# EAGLE design carte_ultrason (EAGLE 6.1)
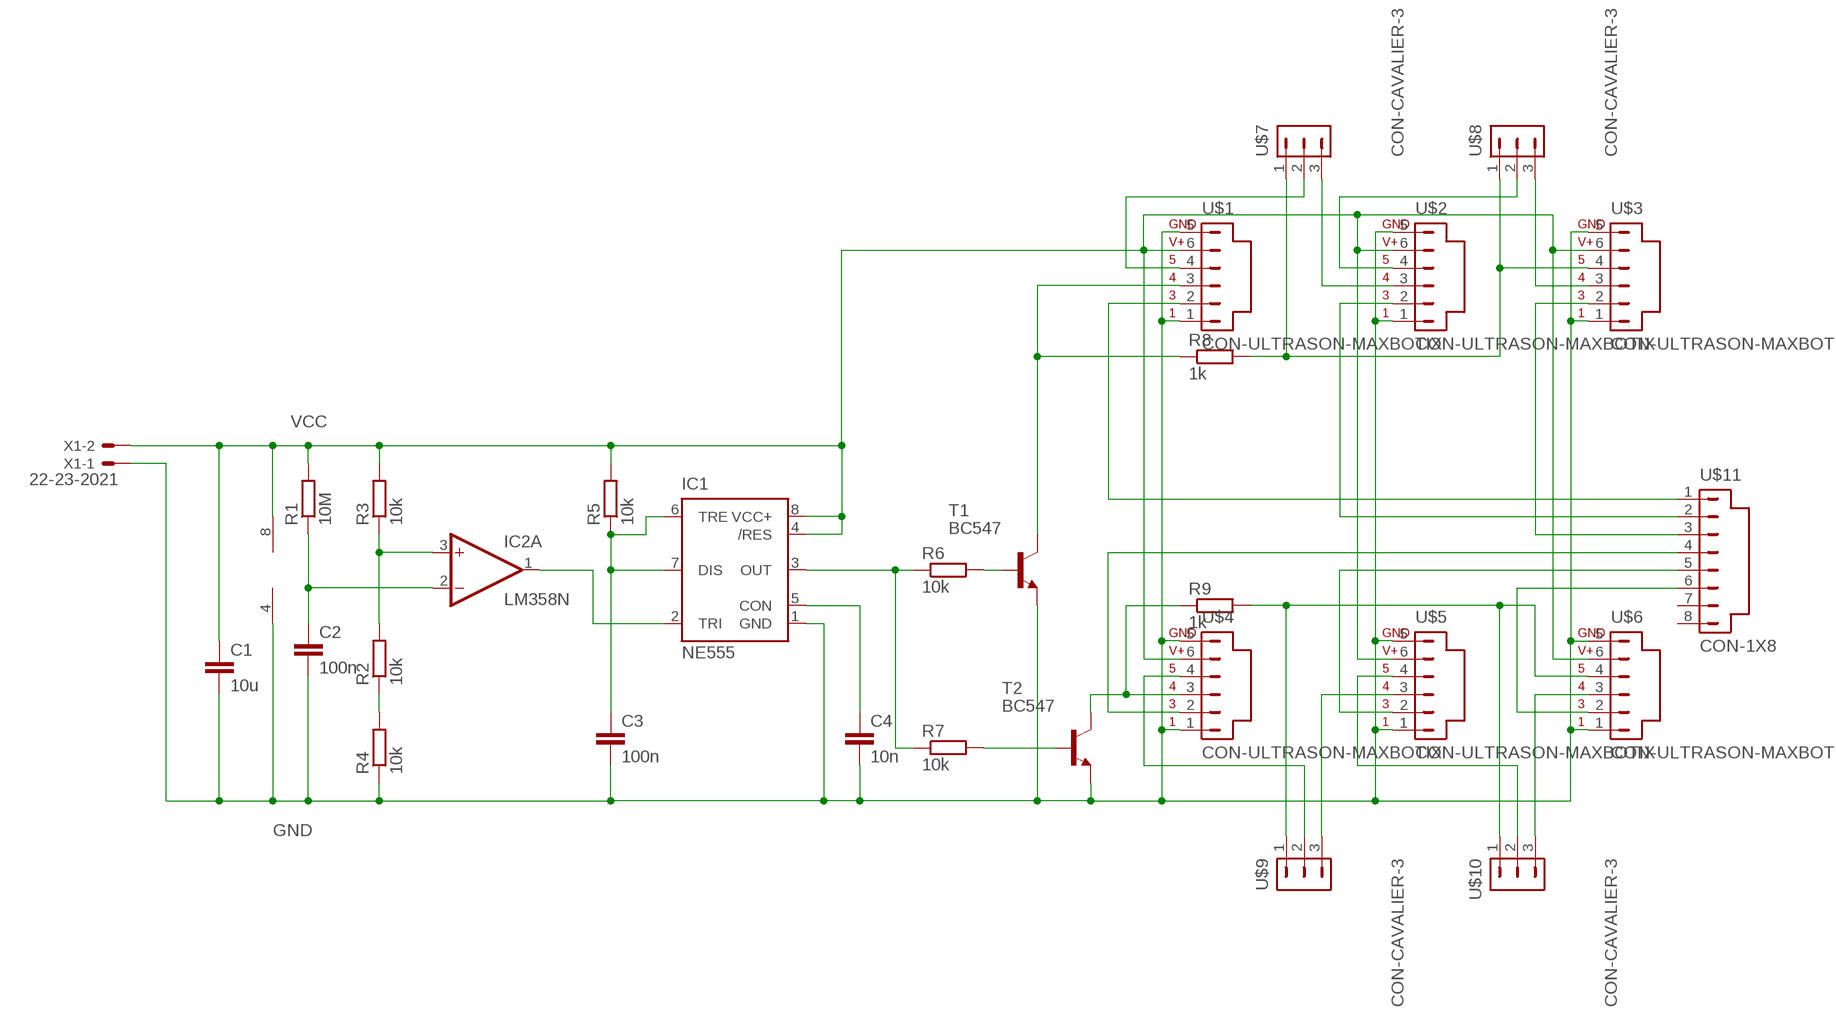
[diagram p0: schematic, sheet 1]

## Parts
C1  10u  C-EUC1206K  [C1206K]
C2  100n  C-EUC0805K  [C0805K]
C3  100n  C-EUC0805K  [C0805K]
C4  10n  C-EUC0805K  [C0805K]
IC1  NE555  [DIL-08]
IC2  LM358N  [DIL08]
R1  10M  R-EU_R0805W  [R0805W]
R2  10k  R-EU_R0805W  [R0805W]
R3  10k  R-EU_0207/10  [0207/10]
R4  10k  R-EU_R0805W  [R0805W]
R5  10k  R-EU_R0805W  [R0805W]
R6  10k  R-EU_0207/10  [0207/10]
R7  10k  R-EU_0207/10  [0207/10]
R8  1k  R-EU_0207/10  [0207/10]
R9  1k  R-EU_R0805W  [R0805W]
T1  BC547  [TO92]
T2  BC547  [TO92]
U$1  CON-ULTRASON-MAXBOTIX  [CON-1X6]
U$2  CON-ULTRASON-MAXBOTIX  [CON-1X6]
U$3  CON-ULTRASON-MAXBOTIX  [CON-1X6]
U$4  CON-ULTRASON-MAXBOTIX  [CON-1X6]
U$5  CON-ULTRASON-MAXBOTIX  [CON-1X6]
U$6  CON-ULTRASON-MAXBOTIX  [CON-1X6]
U$7  CON-CAVALIER-3  [CON-CAVALIER-3]
U$8  CON-CAVALIER-3  [CON-CAVALIER-3]
U$9  CON-CAVALIER-3  [CON-CAVALIER-3]
U$10  CON-CAVALIER-3  [CON-CAVALIER-3]
U$11  CON-1X8  [CON-1X8]
X1  22-23-2021  [22-23-2021]

## Nets
GND: C1.2 C2.2 C3.2 C4.2 IC1.1(GND) IC2.4(P:V-) R4.1 T1.1(E) T2.1(E) U$1.1 U$1.5(GND) U$2.1 U$2.5(GND) U$3.1 U$3.5(GND) U$4.1 U$4.5(GND) U$5.1 U$5.5(GND) U$6.1 U$6.5(GND) X1.1
N$1: IC1.2(TRI) IC2.1(A:OUT)
N$2: C3.1 IC1.6(TRE) IC1.7(DIS) R5.1
N$3: C2.1 IC2.2(A:-IN) R1.1
N$4: R2.1 R4.2
N$5: IC2.3(A:+IN) R2.2 R3.1
N$7: C4.1 IC1.5(CON)
N$8: IC1.3(OUT) R6.1 R7.1
N$9: R6.2 T1.2(B)
N$10: R7.2 T2.2(B)
N$11: U$1.4 U$7.2
N$12: R9.1 T2.3(C) U$4.3
N$13: U$6.2 U$11.6
N$14: U$2.3 U$7.3
N$15: U$2.4 U$8.2
N$16: U$3.3 U$8.3
N$17: U$4.4 U$9.2
N$18: R9.2 U$6.4 U$9.1 U$10.1
N$19: U$5.3 U$9.3
N$20: U$5.4 U$10.2
N$21: U$6.3 U$10.3
N$22: U$5.2 U$11.5
N$23: R8.2 U$3.4 U$7.1 U$8.1
N$24: U$4.2 U$11.4
N$25: U$1.2 U$11.1
N$26: U$3.2 U$11.3
N$27: U$2.2 U$11.2
N$28: R8.1 T1.3(C) U$1.3
VCC: C1.1 IC1.4(/RES) IC1.8(VCC+) IC2.8(P:V+) R1.2 R3.2 R5.2 U$1.6(V+) U$2.6(V+) U$3.6(V+) U$4.6(V+) U$5.6(V+) U$6.6(V+) X1.2
Unconnected: IC2.5(B:+IN) IC2.6(B:-IN) IC2.7(B:OUT) U$11.7 U$11.8

## Library data of the parts
C1-C4 = rcl:C-EU: CAPACITOR, European symbol
IC1 = st-microelectronics:NE555: General purpose bipolar Timer; MF: Arrow Electronics; MPN: NE555N; OC_FARNELL: 1467742; OC_NEWARK: 89K1486
IC2 = linear:LM358: OP AMP also LM158; LM258; LM2904 Source: http://cache.national.com/ds/LM/LM158.pdf
R1-R9 = rcl:R-EU_: RESISTOR, European symbol
T1 T2 = transistor:BC547: NPN TRANSISTOR
U$1-U$6 = neobot:CON-ULTRASON-MAXBOTIX
U$7-U$10 = neobot:CON-CAVALIER-3
U$11 = neobot:CON-1X8
X1 = con-molex:22-23-2021: .100" (2.54mm) Center Header - 2 Pin; MF: MOLEX; MPN: 22-23-2021; OC_FARNELL: 1462926; OC_NEWARK: 25C3832

## Board
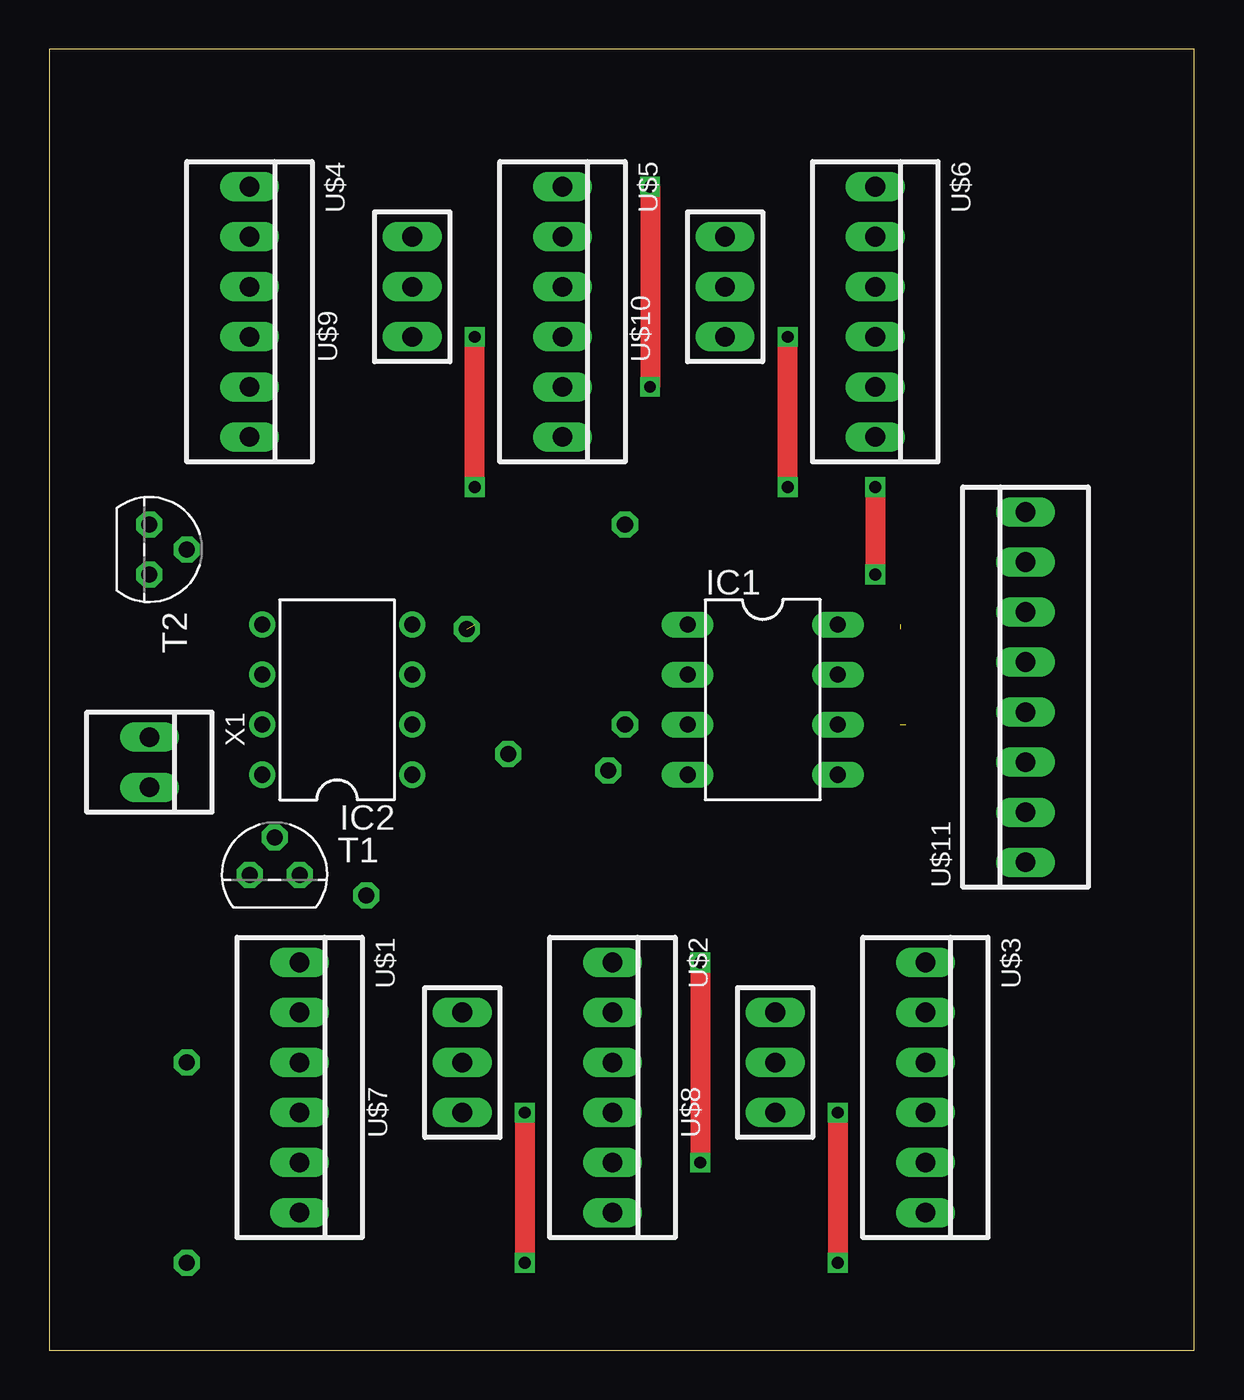
[diagram p1: board, top side]
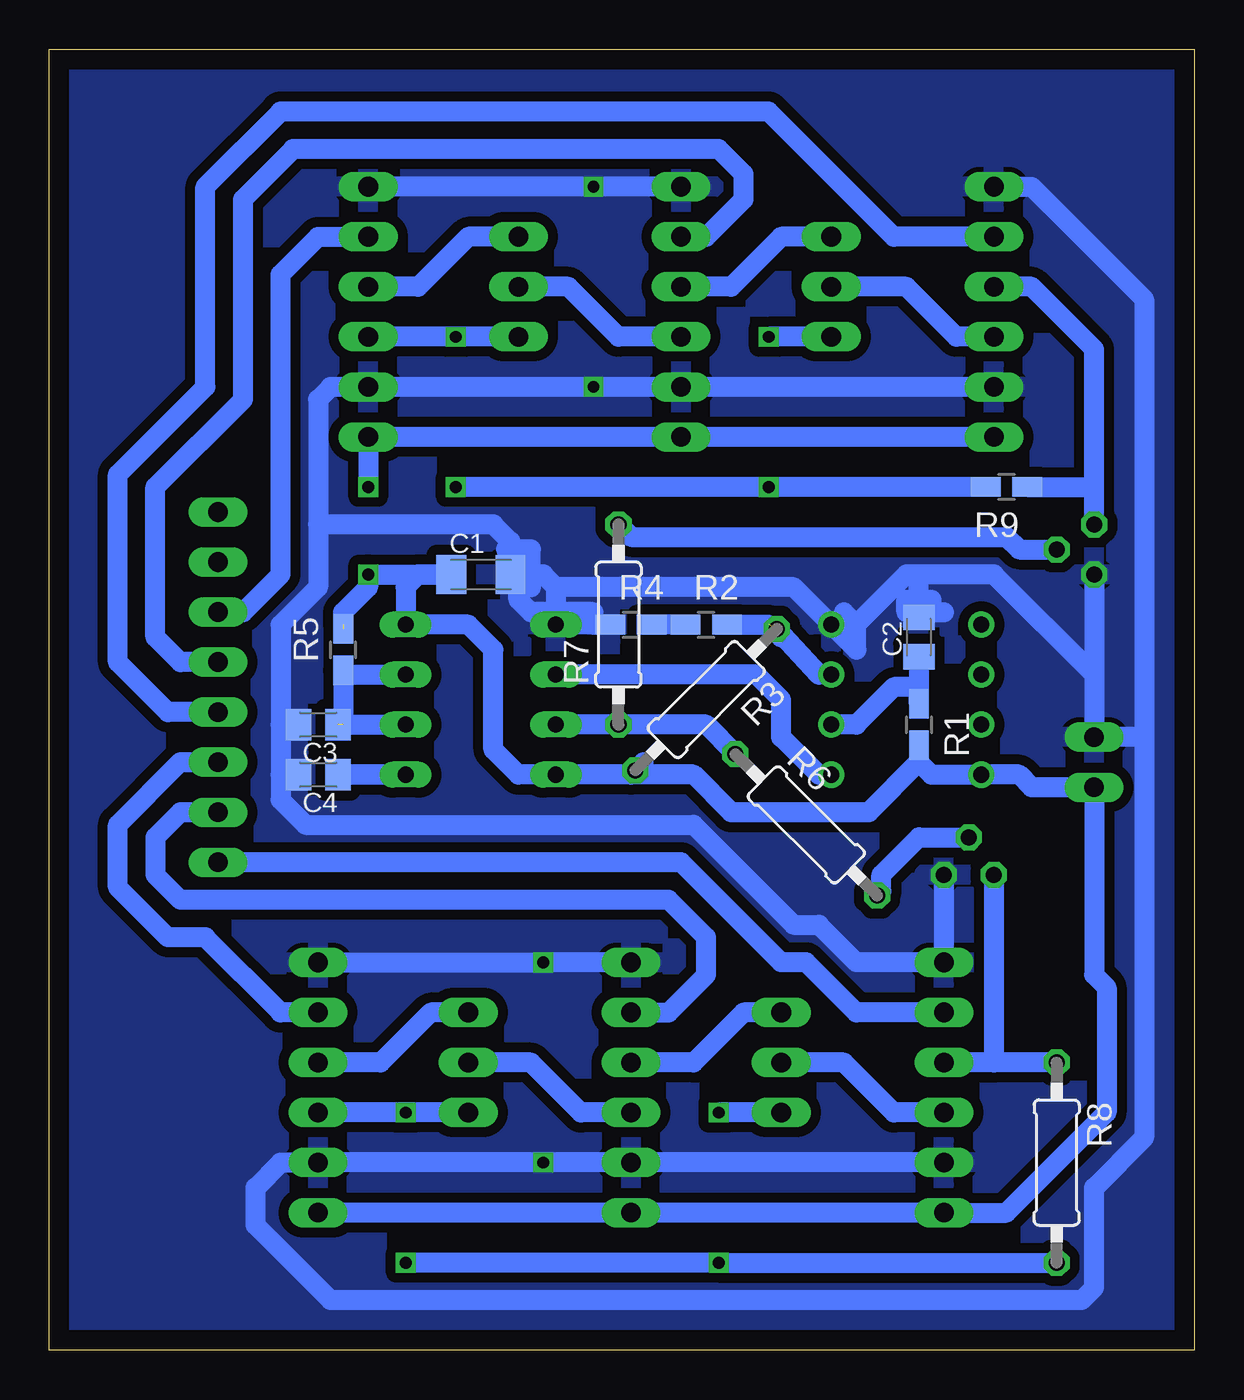
[diagram p2: board, bottom side, seen from below]

Size 58.09 x 66.03 mm. Coordinates in mm from the lower left corner, seen from the top.
Outline: 0,0 58.09,0 58.09,66.03 0,66.03 0,0
Copper layers (1*16): Top 0.035mm / dielectric 1.5mm / Bottom 0.035mm
Design rules: minimum track width 10mil, minimum drill 24mil, track to track 20mil, track to pad 20mil, pad to pad 20mil, via to via 20mil, smd to smd 20mil, copper to edge 40mil, drill to drill 8mil, minimum pad ring 10mil, minimum via ring 8mil, stop-mask expansion 4mil, vias tented up to drill 0mil, thermal gap 10mil

### Footprints (pad centres in the part's own frame; a part is rotated, then mirrored left to right if it is on the bottom)
C1206K = smd 1.5 x 2: 1 -1.5,0; 2 1.5,0
C0805K = smd 1.3 x 1.6: 1 -1,0; 2 1,0
DIL-08 = drill 0.813 long: 1 -3.81,-3.81; 2 -1.27,-3.81; 3 1.27,-3.81; 4 3.81,-3.81; 5 3.81,3.81; 6 1.27,3.81; 7 -1.27,3.81; 8 -3.81,3.81
DIL08 = drill 0.813 pad 1.27: 1 -3.81,-3.81; 2 -1.27,-3.81; 3 1.27,-3.81; 4 3.81,-3.81; 5 3.81,3.81; 6 1.27,3.81; 7 -1.27,3.81; 8 -3.81,3.81
R0805W = smd 1.5 x 1: 1 -1.052,0; 2 1.052,0
0207/10 = drill 0.813 octagon: 1 -5.08,0; 2 5.08,0
TO92 = drill 0.813 octagon: 1 1.27,0; 2 0,1.905; 3 -1.27,0
CON-1X6 = drill 1 long: 1 -6.35,0; 2 -3.81,0; 3 -1.27,0; 4 1.27,0; 5 3.81,0; 6 6.35,0
CON-CAVALIER-3 = drill 1 long: 1 -2.54,0; 2 0,0; 3 2.54,0
CON-1X8 = drill 1 long: 1 -8.89,0; 2 -6.35,0; 3 -3.81,0; 4 -1.27,0; 5 1.27,0; 6 3.81,0; 7 6.35,0; 8 8.89,0
22-23-2021 = drill 1 long: 1 -1.27,0; 2 1.27,0

### Placement (x,y rotation side)
C1  36.2,39.37 0 bottom
C2  13.97,36.2 90 bottom
C3  44.45,31.75 180 bottom
C4  44.45,29.21 180 bottom
IC1  36.2,33.02 270 top
IC2  14.61,33.02 90 top
R1  13.97,31.75 270 bottom
R2  24.77,36.83 0 bottom
R3  24.77,33.02 225 bottom
R4  28.57,36.83 0 bottom
R5  43.18,35.56 90 bottom
R6  19.68,26.67 315 bottom
R7  29.21,36.83 90 bottom
R8  6.99,9.53 270 bottom
R9  9.53,43.81 180 bottom
T1  11.43,24.13 0 top
T2  5.08,40.64 270 top
U$1  12.7,13.34 270 top
U$2  28.57,13.34 270 top
U$3  44.45,13.34 270 top
U$4  10.16,52.7 270 top
U$5  26.04,52.7 270 top
U$6  41.91,52.7 270 top
U$7  20.95,14.61 90 top
U$8  36.83,14.61 90 top
U$9  18.41,53.98 90 top
U$10  34.29,53.98 90 top
U$11  49.53,33.66 90 top
X1  5.08,29.84 270 top

### Tracks (layer width: path | path; a pad name or v marks a point on that pad's centre or on a via)
GND  (via drill 0.6)
  Top 1.016: v33.02,19.68 v33.02,9.53 | v30.48,59.05 v30.48,48.9
  Bottom 1.016: 13.97,39.37 10.16,39.37 5.08,34.29 | 13.97,39.37 14.61,39.37 17.14,36.83 | 17.14,36.83 IC2.4 | C2.2 13.97,37.47 | 13.97,37.47 13.97,39.37 | 32.38,38.73 33.02,39.37 C1.2 | C1.2 34.92,39.37 | C1.2 34.7,41.05 35.56,41.91 44.45,41.91 | U$1.5 U$2.5 v33.02,9.53 U$3.5 46.35,9.53 47.62,8.26 47.62,6.35 43.81,2.54 5.71,2.54 5.08,3.17 5.08,8.26 2.54,10.79 2.54,31.11 | U$2.1 v33.02,19.68 U$3.1 | 2.54,31.11 2.54,53.34 8.26,59.05 U$4.1 | U$4.5 U$5.5 v30.48,48.9 U$6.5 43.81,48.9 44.45,48.26 44.45,41.91 | 32.38,38.73 32.38,37.47 | IC2.4 20.32,38.73 32.38,38.73 | T2.1 5.08,34.29 | 5.08,34.29 X1.1 2.54,31.11 | 44.45,41.91 44.45,38.73 46.35,36.83 46.35,31.75 | R4.1 30.48,36.83 | 30.48,36.83 IC1.1 32.38,37.47 | U$5.1 v30.48,59.05 U$6.1 | T1.1 U$1.1 17.14,19.68 19.05,21.59 20.32,21.59 25.4,26.67 45.09,26.67 46.35,27.94 46.35,29.21 | 46.35,31.75 46.35,29.21 | 46.35,29.21 C4.2 | 45.72,31.75 C3.2 46.35,31.75 | 13.97,37.47 14.61,37.47 14.61,38.1 13.34,38.1 13.34,37.47 12.7,37.47 | IC2.4 17.14,35.56 17.14,36.83 | 17.14,36.83 17.78,37.47 | 30.48,36.83 30.48,37.47 32.38,37.47 | 32.38,37.47 33.66,37.47 34.29,38.1 34.29,38.73 33.66,38.73 33.66,40.64 34.92,40.64
  pour Bottom: 0,0 0,66.04 59.69,66.04 60.33,-0.64
N$1
  Bottom 1.016: IC1.2 22.23,34.29 20.95,33.02 20.95,31.11 19.05,29.21 IC2.1
N$2  (1 unrouted)
  Bottom 1.016: IC1.7 42.96,34.29 R5.1 43.18,31.75 IC1.6
N$3
  Bottom 1.016: R1.1 13.97,33.66 | C2.1 13.97,33.66 | 13.97,33.66 15.24,33.66 17.14,31.75 IC2.2
N$4
  Bottom 1.016: R2.1 R4.2
N$5  (1 unrouted)
  Bottom 1.016: IC2.3 19.05,34.29 R3.1 | R2.2 21.59,36.83 20.95,36.2
N$7
  Bottom 1.016: 43.18,29.21 IC1.5 C4.1
N$8
  Bottom 1.016: IC1.3 R7.1 24.77,31.75 | R6.1 24.77,31.75 | 24.77,31.75
N$9
  Bottom 1.016: R6.2 15.88,23.3 15.88,24.13 13.97,26.04 T1.2
N$10
  Bottom 1.016: R7.2 28.57,41.27 9.53,41.27 8.89,40.64 T2.2
N$11
  Bottom 1.016: U$1.4 15.24,12.06 17.78,14.61 U$7.2
N$12
  Bottom 1.016: U$4.3 8.26,53.98 5.08,50.8 5.08,43.81 | T2.3 5.08,43.81 | R9.1 5.08,43.81
N$13
  Bottom 1.016: 43.18,56.52 U$6.2 44.45,56.52 46.35,54.61 46.35,39.37 48.26,37.47 U$11.6
N$14
  Bottom 1.016: U$7.3 22.86,17.14 25.4,14.61 U$2.3
N$15
  Bottom 1.016: U$2.4 31.11,12.06 33.66,14.61 U$8.2
N$16
  Bottom 1.016: U$8.3 38.73,17.14 41.27,14.61 U$3.3
N$17
  Bottom 1.016: U$4.4 12.06,51.44 14.61,53.98 U$9.2
N$18  (via drill 0.6)
  Top 1.016: v21.59,43.81 v21.59,51.44 | v37.47,43.81 v37.47,51.44
  Bottom 1.016: U$9.1 v21.59,51.44 | U$6.4 v37.47,51.44 U$10.1 | R9.2 v21.59,43.81 v37.47,43.81
N$19
  Bottom 1.016: U$9.3 20.95,56.52 23.5,53.98 U$5.3
N$20
  Bottom 1.016: U$5.4 29.21,51.44 31.75,53.98 U$10.2
N$21
  Bottom 1.016: U$10.3 36.83,56.52 39.37,53.98 U$6.3
N$22
  Bottom 1.016: U$5.2 24.77,56.52 22.86,58.42 22.86,59.69 24.13,60.96 45.72,60.96 48.26,58.42 48.26,48.26 52.7,43.81 52.7,36.2 51.44,34.92 U$11.5
N$23  (via drill 0.6)
  Top 1.016: v24.13,12.06 v24.13,4.45 | v40.01,12.06 v40.01,4.45
  Bottom 1.016: U$8.1 v40.01,12.06 U$3.4 | U$7.1 v24.13,12.06 | v40.01,4.45 v24.13,4.45 R8.2
N$24
  Bottom 1.016: U$4.2 15.24,56.52 21.59,62.87 46.35,62.87 50.16,59.05 50.16,48.9 54.61,44.45 54.61,34.92 52.07,32.38 U$11.4
N$25
  Bottom 1.016: U$1.2 17.14,17.14 19.68,19.68 20.95,19.68 26.04,24.77 U$11.1
N$26
  Bottom 1.016: U$3.2 46.35,17.14 50.16,20.95 52.07,20.95 54.61,23.5 54.61,26.67 51.44,29.84 U$11.3
N$27
  Bottom 1.016: U$2.2 26.67,17.14 24.77,19.05 24.77,20.95 26.67,22.86 51.44,22.86 52.7,24.13 52.7,26.04 51.44,27.3 U$11.2
N$28
  Bottom 1.016: R8.1 10.16,14.61 | 10.16,14.61 U$1.3 | T1.3 10.16,14.61
VCC  (via drill 0.6)  (1 unrouted)
  Top 1.016: v41.91,43.81 v41.91,39.37
  Bottom 1.016: R1.2 13.97,29.84 | 13.97,29.84 13.34,29.21 IC2.8 8.89,29.21 8.26,28.57 X1.2 5.08,19.05 4.45,18.41 4.45,12.06 9.53,6.99 U$1.6 U$2.6 U$3.6 | 13.97,29.84 16.51,27.3 23.5,27.3 25.4,29.21 28.57,29.21 | U$4.6 U$5.6 U$6.6 v41.91,43.81 | 27.94,29.84 R3.2 28.57,29.21 | 28.57,29.21 IC1.4 34.29,29.21 35.56,30.48 35.56,35.56 36.83,36.83 IC1.8 40.01,38.73 39.37,39.37 C1.1 v41.91,39.37 41.91,38.73 43.18,37.47 43.18,36.83